# Altium schematic sheet audio.SchDoc
size A3
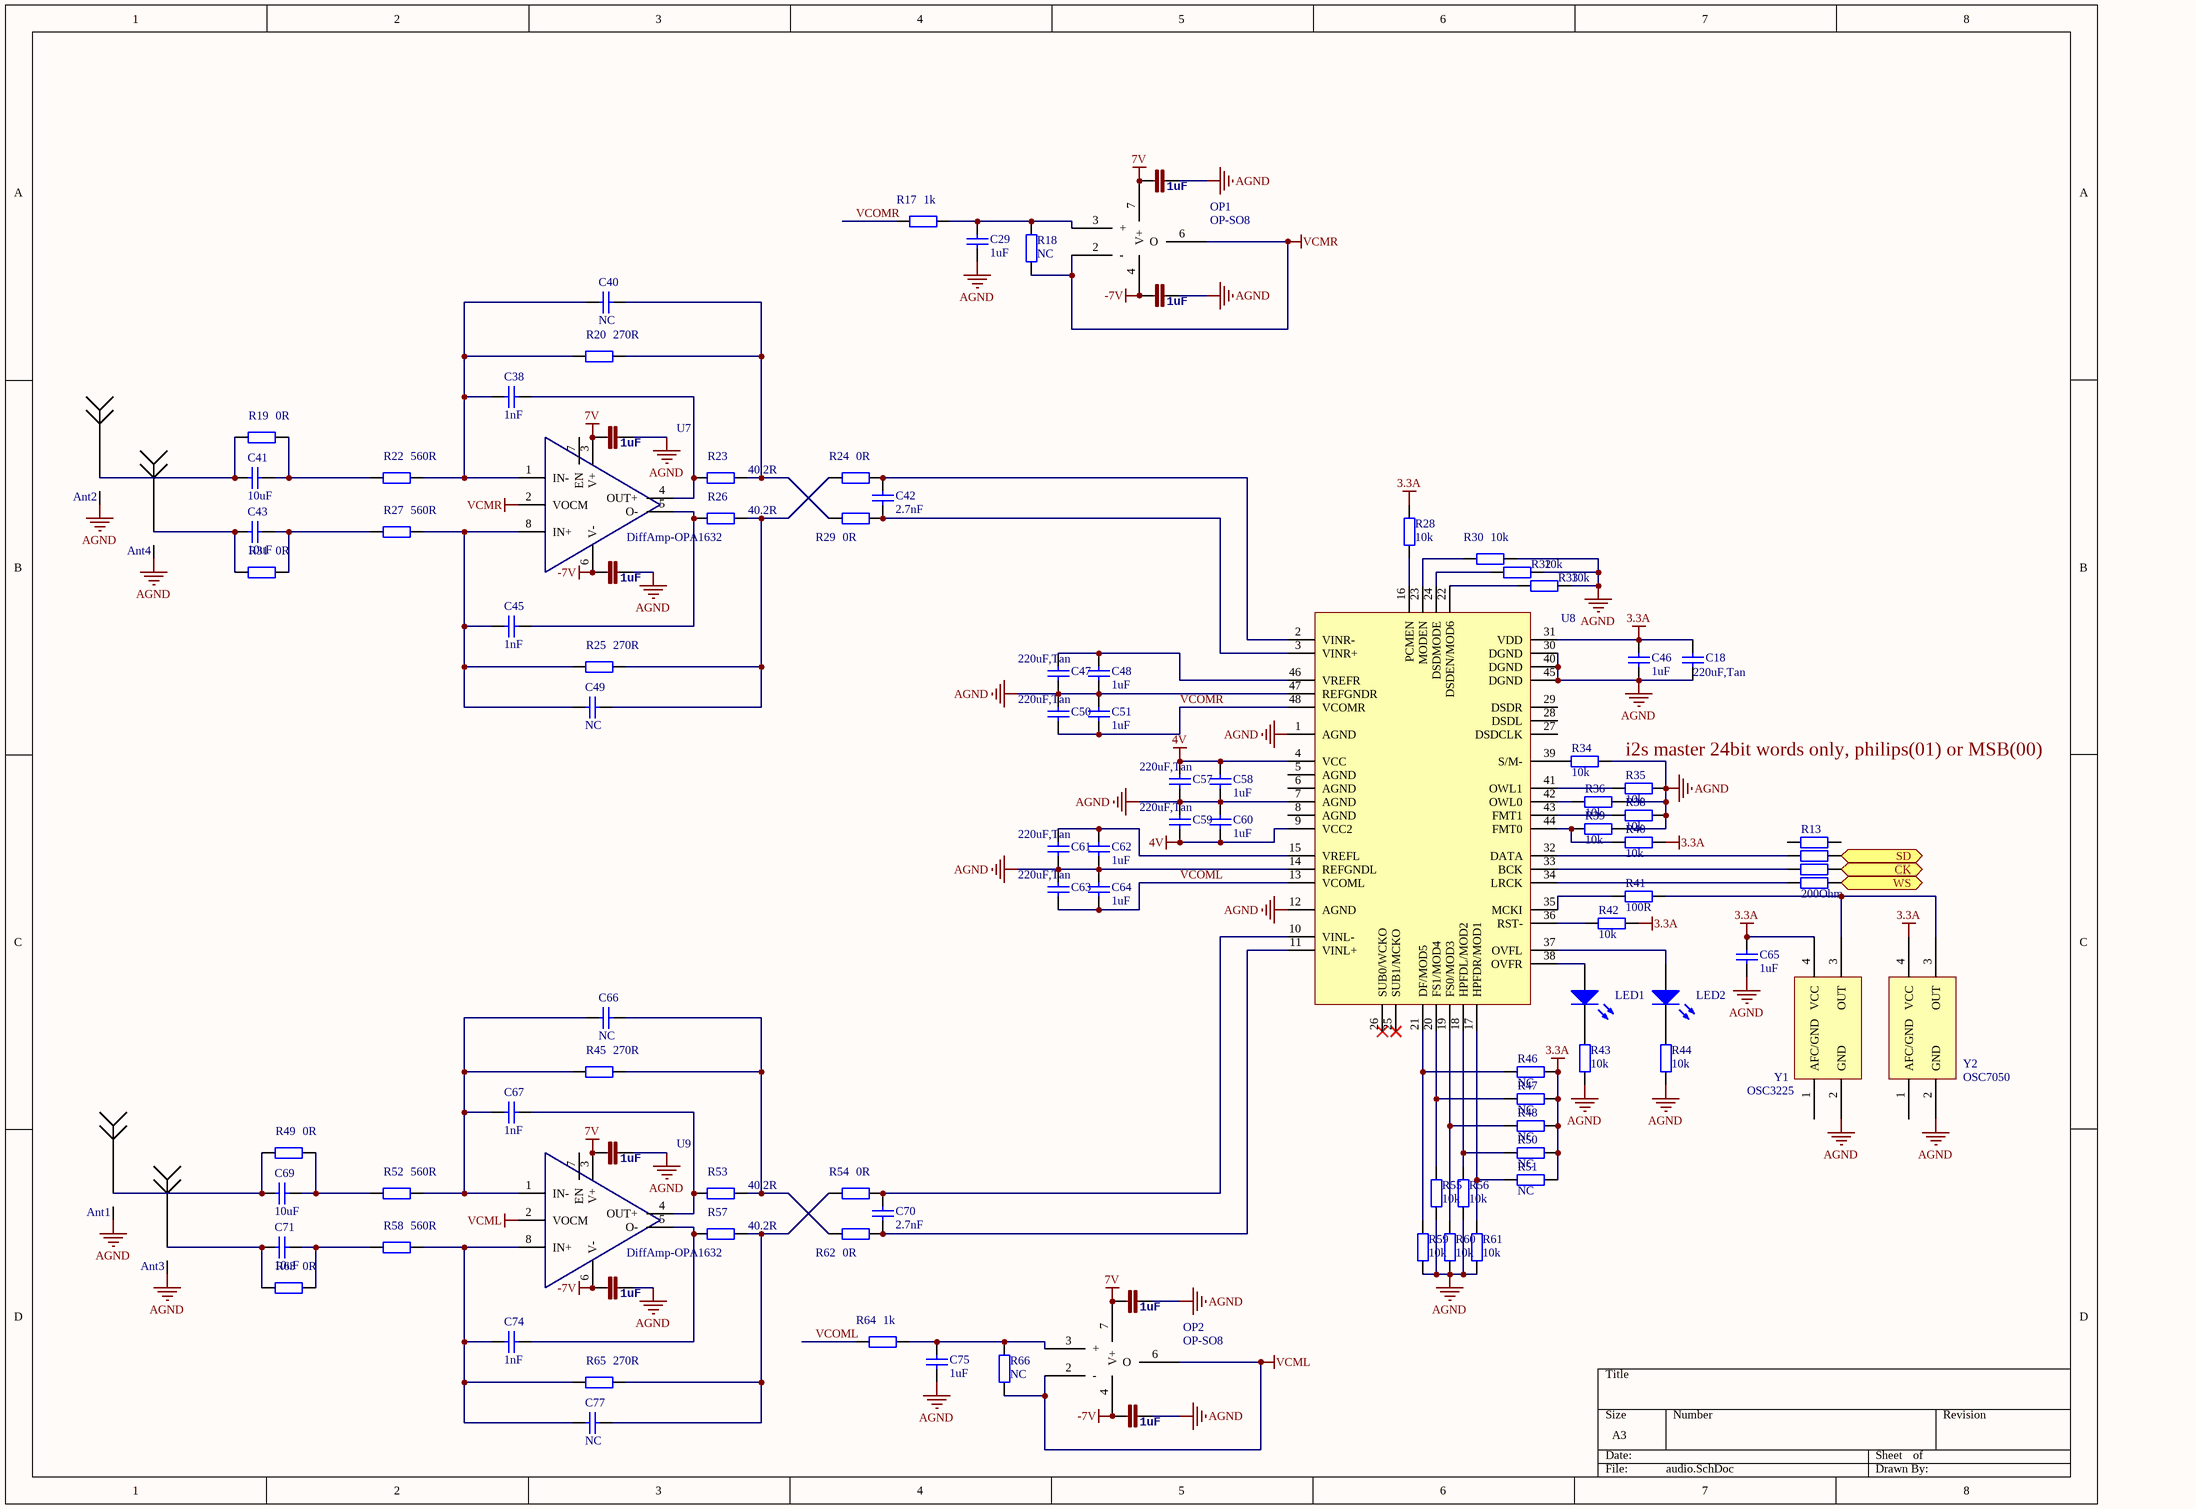
[diagram p0: audio.SchDoc]

## Parts
Ant1  Antenna  [SMA-2C]  (value not drawn)
Ant2  Antenna  [SMA-2C]  (value not drawn)
Ant3  Antenna  [SMA-2C]  (value not drawn)
Ant4  Antenna  [SMA-2C]  (value not drawn)
C18  220uF,Tan  [1210]
C29  1uF  [0402]
C37  1uF  [0603L]
C38  1nF  [0805]
C39  1uF  [0603L]
C40  NC  [0805]
C41  10uF  [CL21-5mm-1F]
C42  2.7nF  [0805]
C43  10uF  [CL21-5mm-1F]
C44  1uF  [0603L]
C45  1nF  [0805]
C46  1uF  [0402]
C47  220uF,Tan  [1210]
C48  1uF  [0402]
C49  NC  [0805]
C50  220uF,Tan  [1210]
C51  1uF  [0402]
C57  220uF,Tan  [1210]
C58  1uF  [0402]
C59  220uF,Tan  [1210]
C60  1uF  [0402]
C61  220uF,Tan  [1210]
C62  1uF  [0402]
C63  220uF,Tan  [1210]
C64  1uF  [0402]
C65  1uF  [0402]
C66  NC  [0805]
C67  1nF  [0805]
C68  1uF  [0603L]
C69  10uF  [CL21-5mm-1F]
C70  2.7nF  [0805]
C71  10uF  [CL21-5mm-1F]
C72  1uF  [0603L]
C73  1uF  [0603L]
C74  1nF  [0805]
C75  1uF  [0402]
C76  1uF  [0603L]
C77  NC  [0805]
C89  1uF  [0603L]
LED1  LED0  [0603]  (value not drawn)
LED2  LED0  [0603]  (value not drawn)
OP1  OP-SO8  [D8]
OP2  OP-SO8  [D8]
R13  value 200Ohm  [0402X4]  (hidden comment: Res*4)
R17  1k  [0402]
R18  NC  [0402]
R19  0R  [0402]
R20  270R  [0402]
R22  560R  [0402]
R23  40.2R  [0805]
R24  0R  [0402]
R25  270R  [0402]
R26  40.2R  [0805]
R27  560R  [0402]
R28  10k  [0402]
R29  0R  [0402]
R30  10k  [0402]
R31  0R  [0402]
R32  10k  [0402]
R33  10k  [0402]
R34  10k  [0402]
R35  10k  [0402]
R36  10k  [0402]
R38  10k  [0402]
R39  10k  [0402]
R40  10k  [0402]
R41  100R  [0402]
R42  10k  [0402]
R43  10k  [0402]
R44  10k  [0402]
R45  270R  [0402]
R46  NC  [0402]
R47  NC  [0402]
R48  NC  [0402]
R49  0R  [0402]
R50  NC  [0402]
R51  NC  [0402]
R52  560R  [0402]
R53  40.2R  [0805]
R54  0R  [0402]
R55  10k  [0402]
R56  10k  [0402]
R57  40.2R  [0805]
R58  560R  [0402]
R59  10k  [0402]
R60  10k  [0402]
R61  10k  [0402]
R62  0R  [0402]
R63  0R  [0402]
R64  1k  [0402]
R65  270R  [0402]
R66  NC  [0402]
U7  DiffAmp-OPA1632  [MSOP8/VSSOP8]
U8  PCM4222-FUNC  [PCM4222]  (value not drawn)
U9  DiffAmp-OPA1632  [MSOP8/VSSOP8]
Y1  OSC3225  [TXC_7Q]
Y2  OSC7050  [OSC7050]

## Ports
CK, SD, WS

## Nets
3.3A: C18.2 C46.2 C65.2 R28.1 R40.2 R42.2 R46.1 R47.2 R48.2 R50.2 R51.1 U8.31(VDD) Y1.4(VCC) Y2.4(VCC)
4V: C57.1 C58.2 C59.2 C60.1 U8.4(VCC) U8.9(VCC2)
7V: C39.2 C68.2 C73.2 C89.2 OP1.7(V+) OP2.7(V+) U7.3(V+) U9.3(V+)
-7V: C37.2 C44.2 C72.2 C76.2 OP1.4 OP2.4 U7.6(V-) U9.6(V-)
AGND: Ant1.GND(G) Ant2.GND(G) Ant3.GND(G) Ant4.GND(G) C18.1 C29.1 C37.1 C39.1 C44.1 C46.1 C47.2 C48.1 C50.1 C51.2 C57.2 C58.1 C59.1 C60.2 C61.2 C62.1 C63.1 C64.2 C65.1 C68.1 C72.1 C73.1 C75.1 C76.1 C89.1 R30.1 R32.1 R33.1 R34.2 R35.2 R36.2 R38.2 R39.2 R43.2 R44.2 R55.1 R56.1 R59.1 R60.1 R61.1 U8.1(AGND) U8.7(AGND) U8.12(AGND) U8.14(REFGNDL) U8.30(DGND) U8.40(DGND) U8.45(DGND) U8.47(REFGNDR) Y1.2(GND) Y2.2(GND)
VCML: OP2.2(-) OP2.6(O) R66.2 U9.2(VOCM)
VCMR: OP1.2(-) OP1.6(O) R18.2 U7.2(VOCM)
CK: R13.7 ; port CK
SD: R13.6 ; port SD
VCOML: C63.2 C64.1 R64.2 U8.13(VCOML)
VCOMR: C50.2 C51.1 R17.2 U8.48(VCOMR)
WS: R13.8 ; port WS
NetAnt1_1: Ant1.1 C69.2 R49.2
NetAnt2_1: Ant2.1 C41.2 R19.2
NetAnt3_1: Ant3.1 C71.2 R63.2
NetAnt4_1: Ant4.1 C43.2 R31.2
NetC29_2: C29.2 OP1.3(+) R17.1 R18.1
NetC38_1: C38.1 R23.2 U7.4(OUT+)
NetC38_2: C38.2 C40.2 R20.2 R22.1 U7.1(IN-)
NetC40_1: C40.1 R20.1 R23.1 R29.2
NetC41_1: C41.1 R19.1 R22.2
NetC42_1: C42.1 R24.1 U8.2(VINR-)
NetC42_2: C42.2 R29.1 U8.3(VINR+)
NetC43_1: C43.1 R27.2 R31.1
NetC45_1: C45.1 R26.2 U7.5(O-)
NetC45_2: C45.2 C49.2 R25.2 R27.1 U7.8(IN+)
NetC47_1: C47.1 C48.2 U8.46(VREFR)
NetC49_1: C49.1 R24.2 R25.1 R26.1
NetC61_1: C61.1 C62.2 U8.15(VREFL)
NetC66_1: C66.1 R45.1 R53.1 R62.2
NetC66_2: C66.2 C67.2 R45.2 R52.1 U9.1(IN-)
NetC67_1: C67.1 R53.2 U9.4(OUT+)
NetC69_1: C69.1 R49.1 R52.2
NetC70_1: C70.1 R54.1 U8.10(VINL-)
NetC70_2: C70.2 R62.1 U8.11(VINL+)
NetC71_1: C71.1 R58.2 R63.1
NetC74_1: C74.1 R57.2 U9.5(O-)
NetC74_2: C74.2 C77.2 R58.1 R65.2 U9.8(IN+)
NetC75_2: C75.2 OP2.3(+) R64.1 R66.1
NetC77_1: C77.1 R54.2 R57.1 R65.1
NetLED1_1: LED1.1(A) U8.38(OVFR)
NetLED1_2: LED1.2(K) R43.1
NetLED2_1: LED2.1(A) U8.37(OVFL)
NetLED2_2: LED2.2(K) R44.1
NetR13_1: R13.1 U8.34(LRCK)
NetR13_2: R13.2 U8.33(BCK)
NetR13_3: R13.3 U8.32(DATA)
NetR28_2: R28.2 U8.16(PCMEN)
NetR30_2: R30.2 U8.23(MODEN)
NetR32_2: R32.2 U8.24(DSDMODE)
NetR33_2: R33.2 U8.22(DSDEN/MOD6)
NetR34_1: R34.1 U8.39(S/M-)
NetR35_1: R35.1 U8.41(OWL1)
NetR36_1: R36.1 U8.42(OWL0)
NetR38_1: R38.1 U8.43(FMT1)
NetR39_1: R39.1 R40.1 U8.44(FMT0)
NetR41_1: R41.1 U8.35(MCKI)
NetR41_2: R41.2 Y1.3(OUT) Y2.3(OUT)
NetR42_1: R42.1 U8.36(RST-)
NetR46_2: R46.2 R59.2 U8.21(DF/MOD5)
NetR47_1: R47.1 R55.2 U8.20(FS1/MOD4)
NetR48_1: R48.1 R60.2 U8.19(FS0/MOD3)
NetR50_1: R50.1 R56.2 U8.18(HPFDL/MOD2)
NetR51_2: R51.2 R61.2 U8.17(HPFDR/MOD1)

Not connected (* = marked no-connect by the designer): R13 4 5; U7 7(EN); U8 5(AGND) 6(AGND) 8(AGND) 25(SUB1/MCKO)* 26(SUB0/WCKO)* 27(DSDCLK) 28(DSDL) 29(DSDR); U9 7(EN); Y1 1(AFC/GND); Y2 1(AFC/GND)

## Notes on the sheet
- i2s master 24bit words only, philips(01) or MSB(00)

## Library data of the parts
C18 C29 C38 C40-C43 C45-C51 C57-C67 C69-C71 C74 C75 C77 = Cap: Capacitor
  C18 C38 C40-C43 C45 C47 C49 C50 C57 C59 C61 C63 C66 C67 C69-C71 C74 C77: Published: 8-Jun-2000; LatestRevisionDate: 17-Jul-2002; LatestRevisionNote: Re-released for DXP Platform.; PackageReference: RAD-0.3; Publisher: Altium Limited; PackageDescription: Radial Cap, Thru-Hole; 2 Leads; 0.3 in Pin Spacing
C37 C39 C44 C68 C72 C73 C76 C89 = CAP0402-CAP: <b>Capacitor</b> / Standard 0603 ceramic capacitor, and 0.1" leaded capacitor.; PARTNO: CC0402ZRY5V7BB104
LED1 LED2 = LED0: Typical INFRARED GaAs LED; Published: 8-Jun-2000; LatestRevisionDate: 08-Jul-2005; LatestRevisionNote: Mech Layer 1 removed.; PackageReference: LED-0; Publisher: Altium Limited; PackageDescription: LED; 2 Leads
R13 = Res*4: Resistor; Published: 8-Jun-2000; LatestRevisionDate: 17-Jul-2002; LatestRevisionNote: Re-released for DXP Platform.; PackageReference: AXIAL-0.4; Publisher: Altium Limited; PackageDescription: Axial Device, Thru-Hole; 2 Leads; 0.4 in Pin Spacing
R17 R18 R23 R24 R26 R28-R30 R32 R33 R53 R54 R57 R62 R64 R66 = Res2: Resistor; Published: 8-Jun-2000; LatestRevisionDate: 17-Jul-2002; LatestRevisionNote: Re-released for DXP Platform.; PackageReference: AXIAL-0.4; Publisher: Altium Limited; PackageDescription: Axial Device, Thru-Hole; 2 Leads; 0.4 in Pin Spacing
R19 R20 R22 R25 R27 R31 R34-R36 R38-R52 R55 R56 R58-R61 R63 R65 = Res2: Resistor; Value: 0Ohm; Published: 8-Jun-2000; LatestRevisionDate: 17-Jul-2002; LatestRevisionNote: Re-released for DXP Platform.; PackageReference: AXIAL-0.4; Publisher: Altium Limited; PackageDescription: Axial Device, Thru-Hole; 2 Leads; 0.4 in Pin Spacing
U7 U9 = DiffAmp
Y1 Y2 = OSC_40M